# Altium schematic sheet sch_ttl_net_ch9120.SchDoc
size A4; SheetNumber: 1; SheetTotal: 1
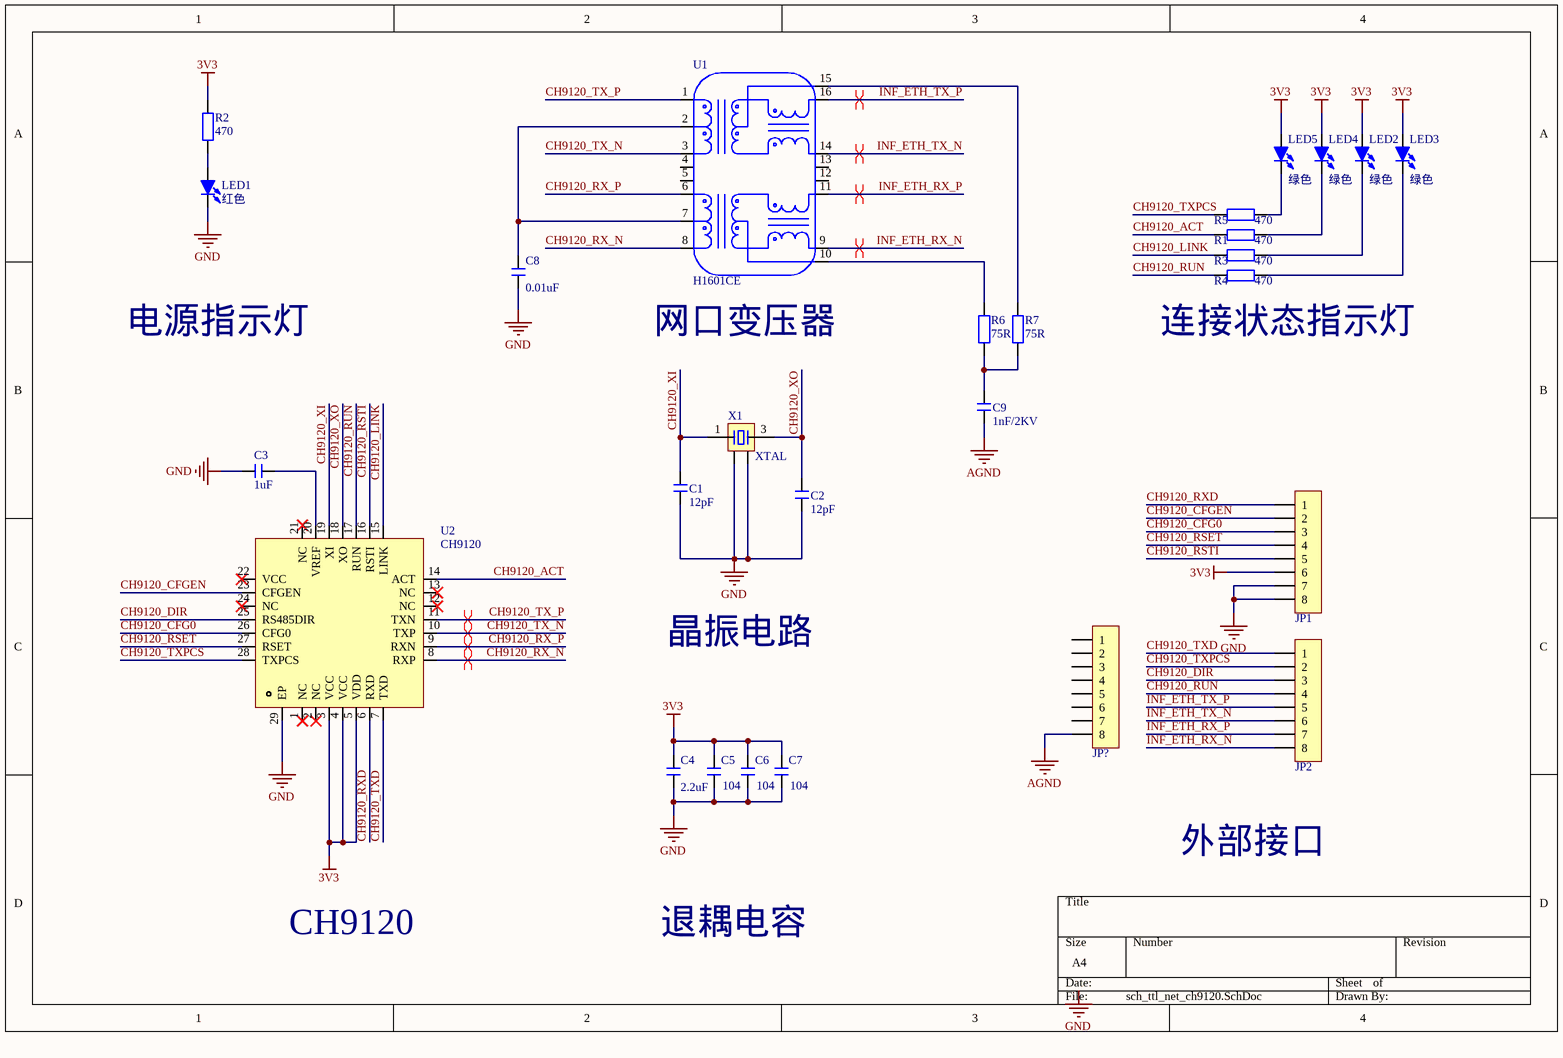
[diagram p0: sch_ttl_net_ch9120.SchDoc]

## Parts
C1  12pF  [C 0402_L]
C2  12pF  [C 0402_L]
C3  1uF  [C 0402_L]
C4  2.2uF  [C 0402_L]
C5  104  [C 0402_L]
C6  104  [C 0402_L]
C7  104  [C 0402_L]
C8  0.01uF  [C 0402_L]
C9  1nF/2KV  [C 1206_L]
JP1  HDR-1X8  [HDR1.27-LI-8P]  (value not drawn)
JP2  HDR-1X8  [HDR1.27-LI-8P]  (value not drawn)
JP?  HDR-1X8  [HDR1.27-LI-8P]  (value not drawn)
LED1  红色  [LED-SMD_0402]
LED2  绿色  [LED-SMD_0402]
LED3  绿色  [LED-SMD_0402]
LED4  绿色  [LED-SMD_0402]
LED5  绿色  [LED-SMD_0402]
R1  470  [R 0402_L]
R2  470  [R 0402_L]
R3  470  [R 0402_L]
R4  470  [R 0402_L]
R5  470  [R 0402_L]
R6  75R  [R 0402_L]
R7  75R  [R 0402_L]
U1  H1601CE  [XFMR-SMD_16P-L12.7-W6.8-P1.27-LS9.5]
U2  CH9120  [WQFN-28_L4.0-W4.0-P0.40-BL-EP]
X1  XTAL  [XTAL-SMD_4P-1612]

## Nets
3V3: C4.1 C5.1 C6.1 C7.1 JP1.6 LED2.1(A) LED3.1(A) LED4.1(A) LED5.1(A) R2.2 U2.3(VCC) U2.4(VCC) U2.5(VDD)
AGND: C9.1 JP?.8
GND: C1.1 C2.1 C3.1 C4.2 C5.2 C6.2 C7.2 C8.2 JP1.7 JP1.8 LED1.2(K) U2.29(EP) X1.2 X1.4
CH9120_ACT: R1.2 U2.14(ACT)
CH9120_CFG0: JP1.3 U2.26(CFG0)
CH9120_CFGEN: JP1.2 U2.23(CFGEN)
CH9120_DIR: JP2.3 U2.25(RS485DIR)
CH9120_LINK: R3.2 U2.15(LINK)
CH9120_RSET: JP1.4 U2.27(RSET)
CH9120_RSTI: JP1.5 U2.16(RSTI)
CH9120_RUN: JP2.4 R4.2 U2.17(RUN)
CH9120_RX_N: U1.8 U2.8(RXP)
CH9120_RX_P: U1.6 U2.9(RXN)
CH9120_RXD: JP1.1 U2.6(RXD)
CH9120_TX_N: U1.3 U2.10(TXP)
CH9120_TX_P: U1.1 U2.11(TXN)
CH9120_TXD: JP2.1 U2.7(TXD)
CH9120_TXPCS: JP2.2 R5.2 U2.28(TXPCS)
CH9120_XI: C1.2 U2.19(XI) X1.1
CH9120_XO: C2.2 U2.18(XO) X1.3
INF_ETH_RX_N: JP2.8 U1.9
INF_ETH_RX_P: JP2.7 U1.11
INF_ETH_TX_N: JP2.6 U1.14
INF_ETH_TX_P: JP2.5 U1.16
NetC3_2: C3.2 U2.20(VREF)
NetC8_1: C8.1 U1.2 U1.7
NetC9_2: C9.2 R6.2 R7.2
NetLED1_1: LED1.1(A) R2.1
NetLED2_2: LED2.2(K) R3.1
NetLED3_2: LED3.2(K) R4.1
NetLED4_2: LED4.2(K) R1.1
NetLED5_2: LED5.2(K) R5.1
NetR6_1: R6.1 U1.10
NetR7_1: R7.1 U1.15

Not connected (* = marked no-connect by the designer): JP? 1 2 3 4 5 6 7; U1 4 5 12 13; U2 1(NC)* 2(NC)* 12(NC)* 13(NC)* 21(NC)* 22(VCC)* 24(NC)*

## Layout directives
differential pair: CH9120_RX_N, CH9120_RX_P, CH9120_TX_N, CH9120_TX_P, INF_ETH_RX_N, INF_ETH_RX_P, INF_ETH_TX_N, INF_ETH_TX_P

## Notes on the sheet
- 电源指示灯
- (near U1) 网口变压器
- (near R4) 连接状态指示灯
- 晶振电路
- 外部接口
- CH9120
- 退耦电容
- Labels drawn without touching a wire or pin: GND

## Library data of the parts
C1-C9 = C: 贴片电容; BOM名称: 无极性贴片电容; 淘宝ID: 封装库来自淘宝 ID：黄晶宝石; 联系售后，技术支持: https://shop463601444.taobao.com; 唯一出售店铺网址: https://shop463601444.taobao.com
JP1 JP2 JP? = Header 8: 8P接插件; 封装库来自淘宝卖家 ID：黄晶宝石: https://shop463601444.taobao.com
LED1-LED5 = LED-SMD: 贴片LED; 版权归属: 封装库来自淘宝 ID：黄晶宝石; BOM名称: 贴片LED; 学习资源: https://item.taobao.com/item.htm?id=566775463719
R1-R7 = R: 贴片电阻; 版权归属: 来自淘宝 ID：黄晶宝石; 封装库来自淘宝卖家 ID：黄晶宝石: 其他店铺购入均为盗版，不享受售后技术支持服务，请立即申请退款; BOM名称: 贴片电阻; 联系售后: https://item.taobao.com/item.htm?id=566775463719
U1 = H1601CE_C206231751_H1601CE_C20623175: 网口变压器
U2 = WQFN-28_L4.0-W4.0-P0.40-BL-EP: 以太网收发器
X1 = XTAL-SMD_4P(2016): 无源晶振